# Altium schematic sheet 12 DMIC.SchDoc
size A2; VersionControl_RevNumber: DNP; IsUserConfigurable: DNP; OrgAddr3: Sunrise FL 33323; OrgName: Pixels on Target; Page Create Date: March  8, 1995; Page Number: 5; Page Size: A2; Page Count: 14; OrgAddr2: Suite #104; RevCode: A; Doc: SCH30-00070-00; DsnPath: C:\Users\Carter Nichols\Documents\BitBucket boards (Cadence)\30-00070-00_Original\SCH30-00070-00.DSN; SchematicName: SC30-00070-00; PageName: 05-POWER IN; PageSize: A2; TopSchematic: True; Address4: United States
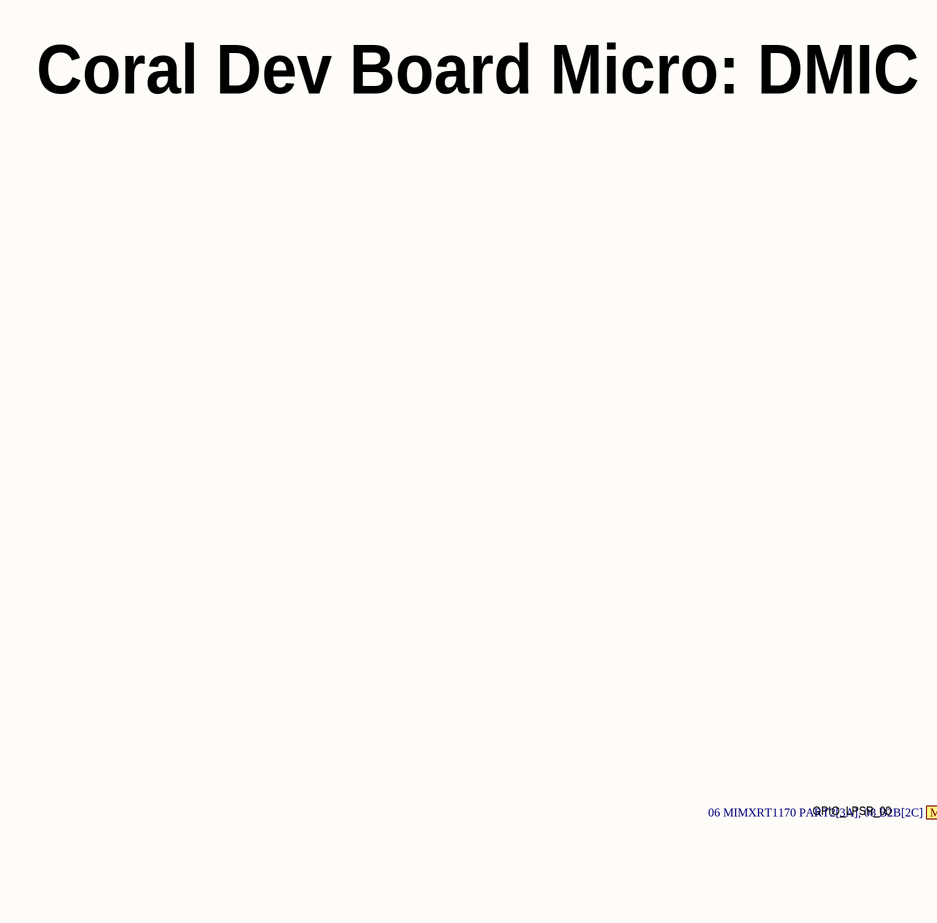
[diagram p0: 12 DMIC.SchDoc, left]
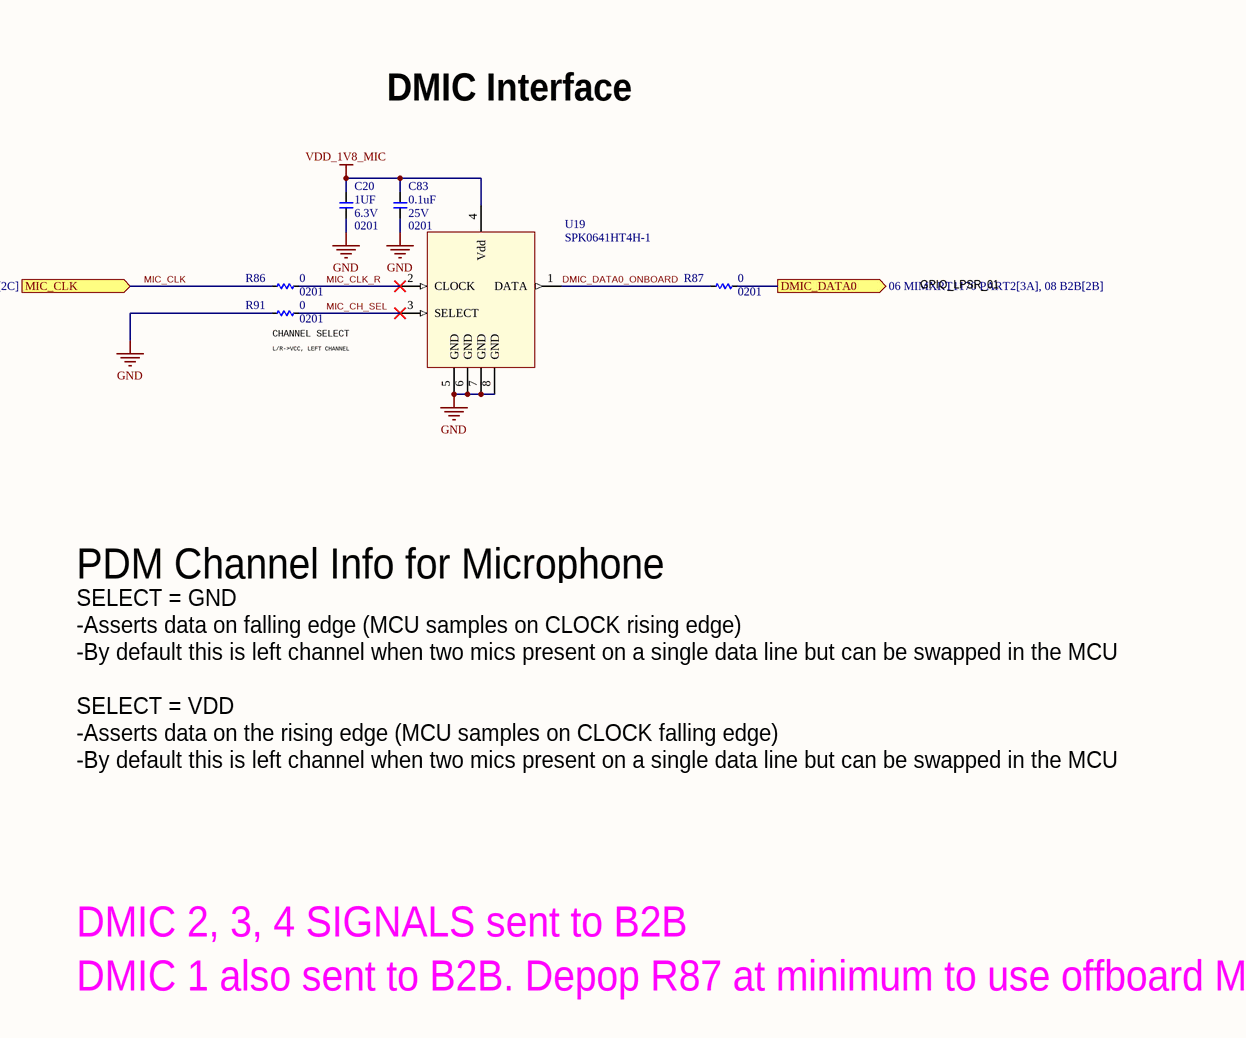
[diagram p1: 12 DMIC.SchDoc, right]

## Parts
C20  value 1UF  Package: 0201  Voltage: 6.3V  [C0201_H0.39MM]  (hidden comment: __Template_Cap)
C83  value 0.1uF  Package: 0201  Voltage: 25V  [C0201Y]  (hidden comment: __Template_Cap)
R86  value 0  Package: 0201  [R0201]
R87  value 0  Package: 0201  [R0201]
R91  value 0  Package: 0201  [R0201]
U19  MFG P/N: SPK0641HT4H-1  [MIC_SPK0641HT4H-1]  (hidden comment: MIC_SPK0641HT4H-1)

## Ports
DMIC_DATA0 (out, see 06 MIMXRT1170 PART2[3A], 08 B2B[2B]), MIC_CLK (in, see 06 MIMXRT1170 PART2[3A], 08 B2B[2C])

## Nets
GND: C20.2 C83.2 R91.1 U19.5(GND) U19.6(GND) U19.7(GND) U19.8(GND)
VDD_1V8_MIC: C20.1 C83.1 U19.4(Vdd)
DMIC_DATA0: R87.2 ; port DMIC_DATA0
DMIC_DATA0_ONBOARD: R87.1 U19.1(DATA)
MIC_CH_SEL: R91.2 U19.3(SELECT)
MIC_CLK: R86.1 ; port MIC_CLK
MIC_CLK_R: R86.2 U19.2(CLOCK)

## Notes on the sheet
- Coral Dev Board Micro: DMIC
- DMIC Interface
- GPIO_LPSR_00
- (near R91) CHANNEL SELECT
- GPIO_LPSR_01
- (near R91) L/R->VCC, LEFT CHANNEL
- PDM Channel Info for Microphone
- SELECT = GND
  -Asserts data on falling edge (MCU samples on CLOCK rising edge)
  -By default this is left channel when two mics present on a single data line but can be swapped in the MCU
  SELECT = VDD
  -Asserts data on the rising edge (MCU samples on CLOCK falling edge)
  -By default this is left channel when two mics present on a single data line but can be swapped in the MCU
- DMIC 2, 3, 4 SIGNALS sent to B2B
- DMIC 1 also sent to B2B. Depop R87 at minimum to use offboard MIC1 left channel.
- Title
- Size:
- Date:
- File:
- A2
- Number:
- Time:
- Revision:
- Sheet
- of

## Library data of the parts
C20 = 1771: CAP, CER, X6S, 1uF, 20%, 6.3V, 0201, 0.39mm; ID: 1771; MFG: MURATA; MFG P/N: GRM033C80J105ME05D; EPIC: G150-02531-00; Status: In Development; Dielectric: X6S; Tolerance: 20%; Height: 0.39mm; Supplier 1: Digi-Key; HelpURL: https://www.digikey.com/product-detail/en/murata-electronics-north-america/GRM033C80J105ME05D/490-13218-1-ND/5877426; ComponentLink1Description: Datasheet; ComponentLink1URL: https://psearch.en.murata.com/capacitor/product/GRM033C80J105ME05%23.pdf; Supplier Part Number 1: 490-13218-1-ND
C83 = 386: CAP, CER, X5R, 0.1uF, 25V, 20%, 0201, 0.33mm T; ID: 386; MFG: MURATA; MFG P/N: GRM033R61E104ME14D; XPN: 150-01204-00; Status: Released; Dielectric: X5R; Tolerance: 20%; Height: 0.33mm T; ComponentLink1Description: Datasheet; COMMON: 150-01204-00; LOON: 150-01204-00; Gecko: 150-01204-00
R86 R87 R91 = 8315: RES, 0.0, 1/20W, 0201; ID: 8315; MFG: PANASONIC; MFG P/N: ERJ1GN0R00C; Tolerance: JUMPER; COMMON: 470-00013-00; PROXY: Use ID #6940; Status: Released; Power: 1/20W; LOON: 470-00013-00; Gecko: 470-00013-00; XPN: 470-00013-00
U19 = 212: AUDIO, MIC, MEMS, OMNIDIRECTIONAL, DIGITAl/PDM O/P, 20Hz TO 20KHz, -26dB SENSITIVITY, +/-1dB, 64.5dB S/N R, SMD; ID: 212; MFG: Knowles; Voltage, Rated: 1.6 V ~ 3.6 V; Status: Released; Category: Microphones; RoHS Compliant: Yes; Supplier 1: Digi-Key; Height: 1.1mm; Mounting Type: SMD; HelpURL: https://www.digikey.com/en/products/detail/knowles/SPK0641HT4H-1/8573345; ComponentLink1Description: Datasheet; ComponentLink1URL: https://www.knowles.com/docs/default-source/model-downloads/spk0641ht4h-1-rev-a.pdf; Supplier Part Number 1: 423-1425-2-ND